# EAGLE design ESP01_ManualPushbutton (EAGLE 9.5.2)
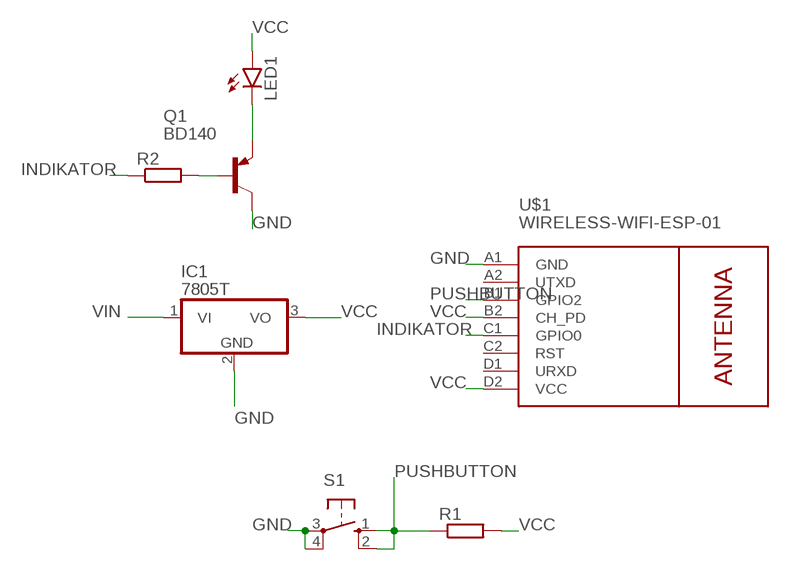
[diagram p0: schematic, sheet 1]

## Parts
IC1  7805T  [TO220H]
LED1  LED5MM  [LED5MM]
Q1  BD140  [TO126]
R1  R-EU_0207/10  [0207/10]
R2  R-EU_0207/10  [0207/10]
S1  10-XX  [B3F-10XX]
U$1  WIRELESS-WIFI-ESP-01  [WIRELESS-WIFI-ESP-01]

## Nets
GND: IC1.2(GND) Q1.2(C) S1.3(P) S1.4(P1) U$1.A1(GND)
INDIKATOR: R2.1 U$1.C1(GPIO0)
N$1: Q1.3(B) R2.2
N$2: LED1.K(C) Q1.1(E)
PUSHBUTTON: R1.1 S1.1(S) S1.2(S1) U$1.B1(GPIO2)
VCC: IC1.3(VO) LED1.A R1.2 U$1.B2(CH_PD) U$1.D2(VCC)
VIN: IC1.1(VI)
Unconnected: U$1.A2(UTXD) U$1.C2(RST) U$1.D1(URXD)

## Library data of the parts
IC1 = linear:78*: Positive VOLTAGE REGULATOR Source: http://cache.national.com/ds/LM/LM78L05.pdf http://www.fairchildsemi.com/ds/LM/LM7805.pdf
LED1 = led:LED: LED OSRAM: - CHIPLED LG R971, LG N971, LY N971, LG Q971, LY Q971, LO R971, LY R971 LH N974, LH R974 LS Q976, LO Q976, LY Q976 LO Q996 - Hyper CHIPLED LW Q18S LB Q993, LB Q99A, LB R99A - SideLED LS A670, LO A670, LY A670, LG A670, LP A670 LB A673, LV A673, LT A673, LW A673 LH A674 LY A675 LS A676, LA A676, LO A676, LY A676, LW A676 LS A679, LY A679, LG A679 - Hyper Micro SIDELED® LS Y876, LA Y876, LO Y876, LY Y876 LT Y87S - SmartLED LW L88C, LW L88S LB L89C, LB L89S, LG L890 LS L89K, LO L89K, LY L89K LS L896, LA L896, LO L896, LY L896 - TOPLED LS T670, LO T670, LY T670, LG T670, LP T670 LSG T670, LSP T670, LSY T670, LOP T670, LYG T670 LG T671, LOG T671, LSG T671 LB T673, LV T673, LT T673, LW T673 LH T674 LS T676, LA T676, LO T676, LY T676, LB T676, LH T676, LSB T676, LW T676 LB T67C, LV T67C, LT T67C, LS T67K, LO T67K, LY T67K, LW E67C LS E67B, LA E67B, LO E67B, LY E67B, LB E67C, LV E67C, LT E67C LW T67C LS T679, LY T679, LG T679 LS T770, LO T770, LY T770, LG T770, LP T770 LB T773, LV T773, LT T773, LW T773 LH T774 LS E675, LA E675, LY E675, LS T675 LS T776, LA T776, LO T776, LY T776, LB T776 LHGB T686 LT T68C, LB T68C - Hyper Mini TOPLED® LB M676 - Mini TOPLED Santana® LG M470 LS M47K, LO M47K, LY M47K Source: http://www.osram.convergy.de LUXEON: - LUMILED® LXK2-PW12-R00, LXK2-PW12-S00, LXK2-PW14-U00, LXK2-PW14-V00 LXK2-PM12-R00, LXK2-PM12-S00, LXK2-PM14-U00 LXK2-PE12-Q00, LXK2-PE12-R00, LXK2-PE12-S00, LXK2-PE14-T00, LXK2-PE14-U00 LXK2-PB12-K00, LXK2-PB12-L00, LXK2-PB12-M00, LXK2-PB14-N00, LXK2-PB14-P00, LXK2-PB14-Q00 LXK2-PR12-L00, LXK2-PR12-M00, LXK2-PR14-Q00, LXK2-PR14-R00 LXK2-PD12-Q00, LXK2-PD12-R00, LXK2-PD12-S00 LXK2-PH12-R00, LXK2-PH12-S00 LXK2-PL12-P00, LXK2-PL12-Q00, LXK2-PL12-R00 Source: www.luxeon.com KINGBRIGHT: KA-3528ASYC Source: www.kingbright.com
Q1 = transistor-pnp:BD140: PNP Transistor
R1 R2 = rcl:R-EU_: RESISTOR, European symbol; SPICEPREFIX: R
S1 = switch-omron:10-XX: OMRON SWITCH; MPN: B3F-1000; OC_FARNELL: 176432; OC_NEWARK: 36M3542
U$1 = diy-modules:WIRELESS-WIFI-ESP-01: Wireless Wi-Fi ESP-01 Module based on ESP8266 chip Click here to find device on ebay.com <http://www.ebay.com/sch/esp8266+esp+01+transceiver>

## Board
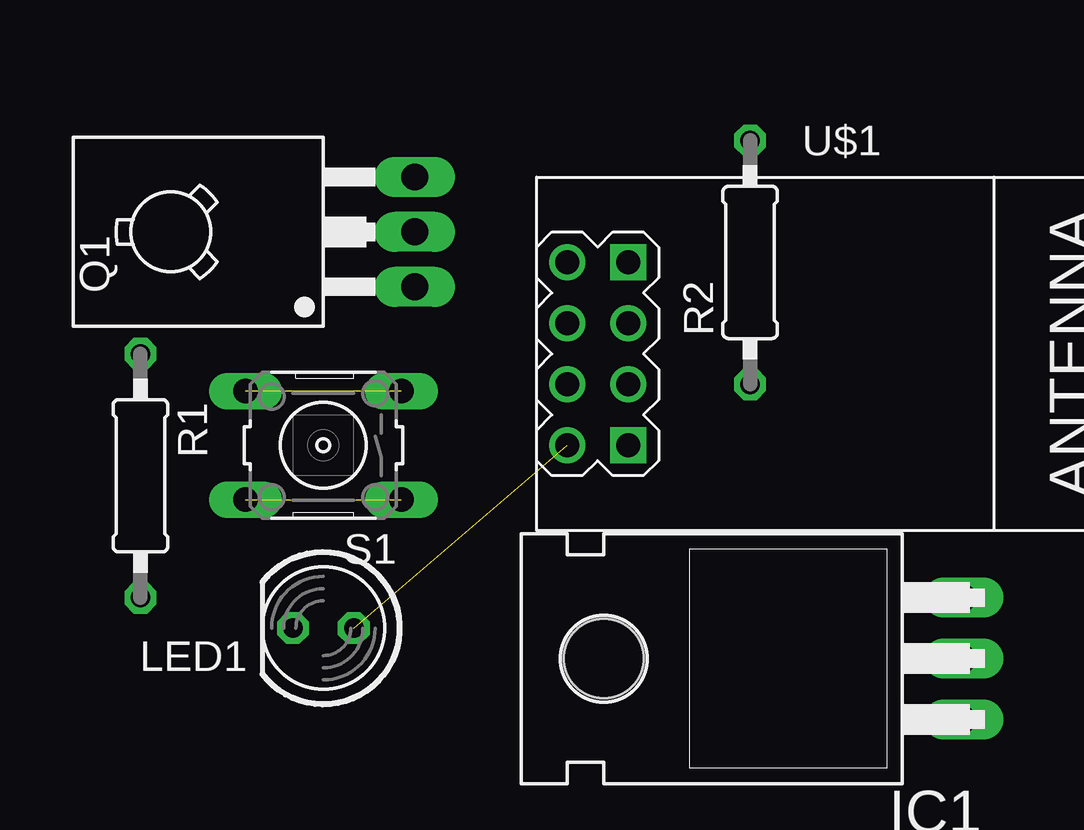
[diagram p1: board, top side]
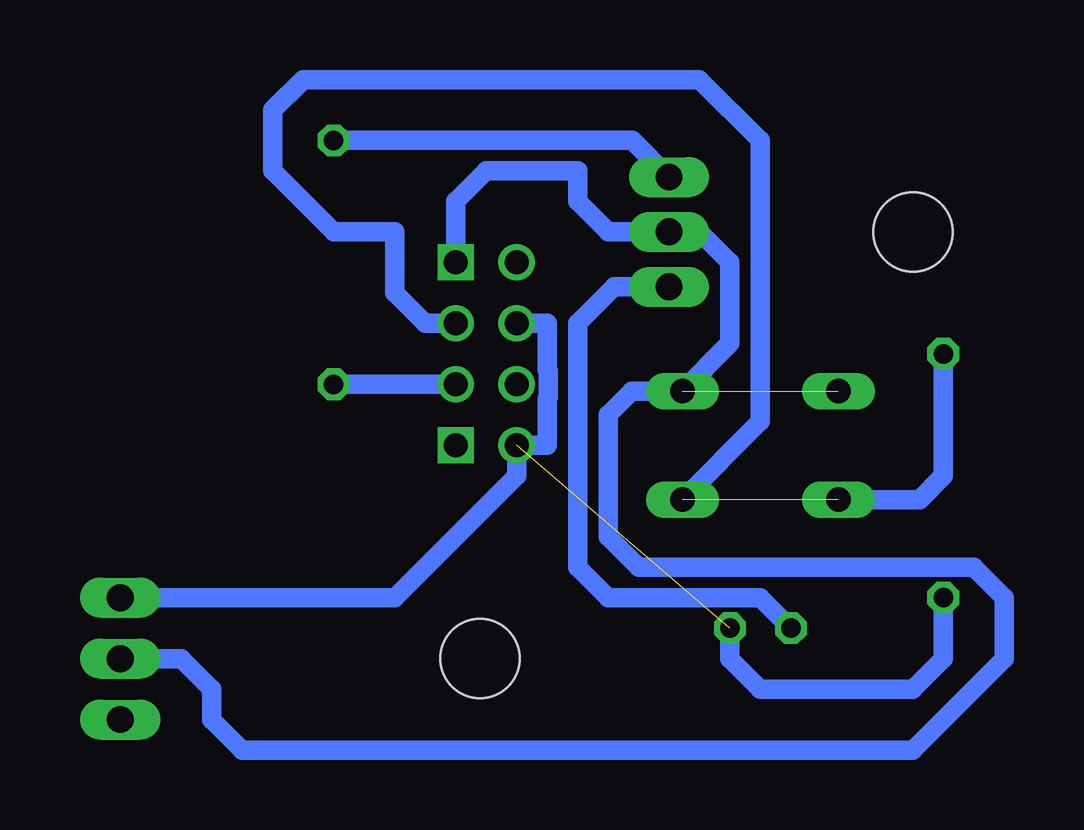
[diagram p2: board, bottom side, seen from below]

No outline drawn. Coordinates in mm, seen from the top.
Copper layers (1*16): Top 0.035mm / dielectric 1.5mm / Bottom 0.035mm
Design rules "default": minimum track width 6mil, minimum drill 0.35mm, track to track 6mil, track to pad 6mil, pad to pad 6mil, via to via 6mil, smd to smd 6mil, copper to edge 40mil, drill to drill 6mil, minimum pad ring 10mil, minimum via ring 8mil, stop-mask expansion 4mil, vias tented up to drill 0mil, thermal gap 10mil

### Footprints (pad centres in the part's own frame; a part is rotated, then mirrored left to right if it is on the bottom)
TO220H = drill 1.118 long: 1 -2.54,-10.16; 2 0,-10.16; 3 2.54,-10.16 | hole 3.302: 0,4.826
LED5MM = drill 0.813 octagon: A -1.27,0; K 1.27,0
TO126 = drill 1.118 long: 1 -2.286,-5.08; 2 0,-5.08; 3 2.286,-5.08 | hole 3.302: 0,5.08
0207/10 = drill 0.813 octagon: 1 -5.08,0; 2 5.08,0
B3F-10XX = drill 1.016 long: 1 -3.251,2.261; 2 3.251,2.261; 3 -3.251,-2.261; 4 3.251,-2.261
WIRELESS-WIFI-ESP-01 = drill 1 square: A1 -8.89,3.81; D1 -8.89,-3.81 | drill 1: A2 -11.43,3.81; B1 -8.89,1.27; B2 -11.43,1.27; C1 -8.89,-1.27; C2 -11.43,-1.27; D2 -11.43,-3.81

### Placement (x,y rotation side)
IC1  66.04,34.29 90 top
LED1  49.53,35.56 180 top
Q1  48.26,52.07 90 top
R1  41.91,41.91 270 top
R2  67.31,50.8 90 top
S1  49.53,43.18 180 top
U$1  71.12,46.99 0 top

### Tracks (layer width: path | path; a pad name or v marks a point on that pad's centre or on a via)
GND  (1 unrouted)
  Bottom 0.813: U$1.A1 62.23,53.34 60.96,54.61 57.15,54.61 57.15,53.34 55.88,52.07 Q1.2 52.07,52.07 50.8,50.8 50.8,47.42 S1.3 54.89,45.44 55.88,44.45 55.88,39.37 54.61,38.1 40.64,38.1 39.37,36.83 39.37,34.29 43.18,30.48 71.12,30.48 72.39,31.75 72.39,33.02 73.66,34.29 IC1.2
INDIKATOR
  Bottom 0.813: U$1.C1 R2.1
N$1
  Bottom 0.813: Q1.3 54.86,55.88 R2.2
N$2
  Bottom 0.813: Q1.1 55.63,49.78 57.15,48.26 57.15,38.1 55.88,36.83 49.53,36.83 LED1.K
PUSHBUTTON  (1 unrouted)
  Bottom 0.813: R1.1 41.91,41.91 42.9,40.92 S1.2 | S1.1 49.53,44.17 49.53,55.88 52.07,58.42 68.58,58.42 69.85,57.15 69.85,54.61 67.31,52.07 64.77,52.07 64.77,49.53 63.5,48.26 U$1.B1
VCC  (1 unrouted)
  Bottom 0.813: IC1.3 64.77,36.83 59.69,41.91 U$1.D2 58.42,43.18 58.42,45.13 58.38,45.18 58.38,46.26 58.42,46.31 58.42,48.26 U$1.B2 | LED1.A 50.8,34.29 49.53,33.02 43.18,33.02 41.91,34.29 R1.2